# EAGLE design ngptv-lite-v11 (EAGLE 8.4.3)
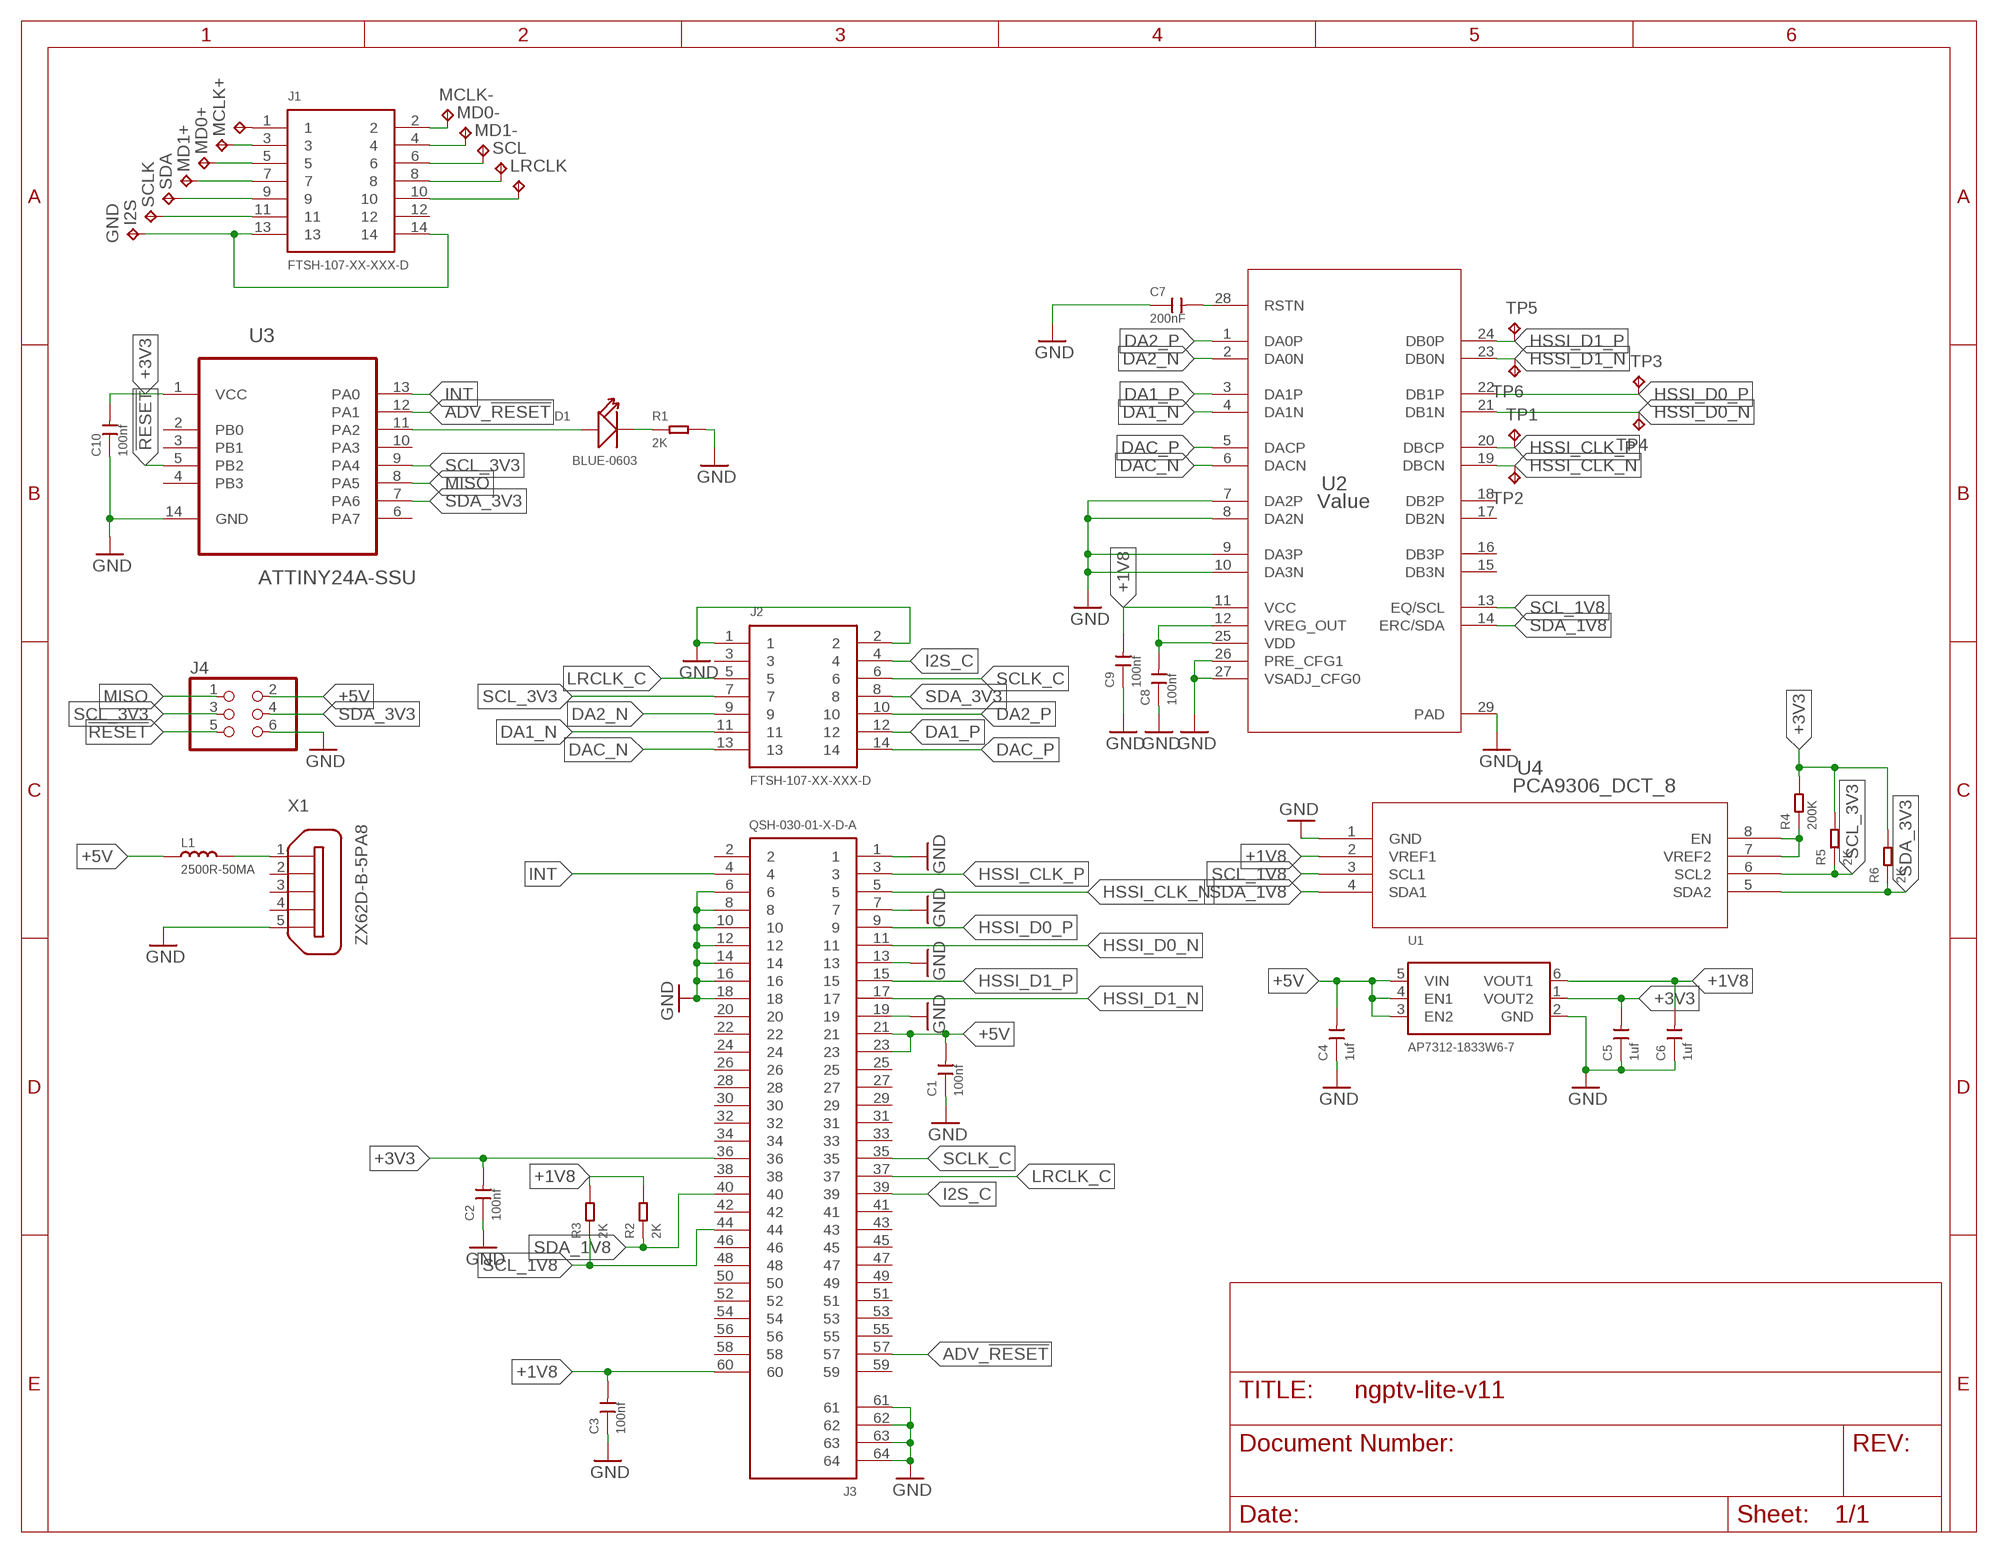
[diagram p0: schematic, sheet 1]

## Parts
C1  100nf  CERAMIC-100NF-50V-10%-X7R(0603)  [C0603]
C2  100nf  CERAMIC-100NF-50V-10%-X7R(0603)  [C0603]
C3  100nf  CERAMIC-100NF-50V-10%-X7R(0603)  [C0603]
C4  1uf  CERAMIC-1UF-25V-10%-X7R(0603)  [C0603]
C5  1uf  CERAMIC-1UF-25V-10%-X7R(0603)  [C0603]
C6  1uf  CERAMIC-1UF-25V-10%-X7R(0603)  [C0603]
C7  200nF  CERAMIC-220NF-25V-10%-X7R(0603)  [C0603]
C8  100nf  CERAMIC-100NF-50V-10%-X7R(0603)  [C0603]
C9  100nf  CERAMIC-100NF-50V-10%-X7R(0603)  [C0603]
C10  100nf  CERAMIC-100NF-50V-10%-X7R(0603)  [C0603]
D1  BLUE-0603  SMD-LED-CLEAR-BLUE(0603)  [LED-0603]
GND  TPTP14R  [TP14R]
I2S  TPTP12R  [TP12R]
J1  FTSH-107-XX-XXX-D  [FTSH-107-XX-XXX-D]
J2  FTSH-107-XX-XXX-D  [FTSH-107-XX-XXX-D]
J3  QSH-030-01-X-D-A  [QSH-030-01-X-D-A]
J4  PINHD-2X3/90  [2X03/90]
L1  2500R-50MA  SMD-FERRITE-BEAD-2500R-50MA(0603)  [L0603]
LRCLK  TPTP12R  [TP12R]
MCLK+  TPTP12R  [TP12R]
MCLK-  TPTP12R  [TP12R]
MD0+  TPTP12R  [TP12R]
MD0-  TPTP12R  [TP12R]
MD1+  TPTP12R  [TP12R]
MD1-  TPTP12R  [TP12R]
R1  2K  SMD-RES-1K-1%-1/10W(0603)  [R0603]
R2  2K  SMD-RES-2K-5%-1/10W(0603)  [R0603]
R3  2K  SMD-RES-2K-5%-1/10W(0603)  [R0603]
R4  200K  SMD-RES-200K-5%-1/10W(0603)  [R0603]
R5  2K  SMD-RES-2K-5%-1/10W(0603)  [R0603]
R6  2K  SMD-RES-2K-5%-1/10W(0603)  [R0603]
SCL  TPTP12R  [TP12R]
SCLK  TPTP12R  [TP12R]
SDA  TPTP12R  [TP12R]
TP1  TPTP06SQ  [TP06SQ]
TP2  TPTP06SQ  [TP06SQ]
TP3  TPTP06SQ  [TP06SQ]
TP4  TPTP06SQ  [TP06SQ]
TP5  TPTP06SQ  [TP06SQ]
TP6  TPTP06SQ  [TP06SQ]
U1  AP7312-1833W6-7  AP7312  [SOT95P280X145-6N]
U2  Value  SN75DPHY440SS  [RHR0028A_NV]
U3  ATTINY24A-SSU  [SOIC127P600X175-14N]
U4  PCA9306_DCT_8  [DCT8]
X1  ZX62D-B-5PA8  [ZX62D-B-5PA8]

## Nets
!RESET: J4.5 U3.5(PB2)
+1V8: C3.2 C6.2 C9.2 J3.60 R2.2 R3.2 U1.6(VOUT1) U2.11(VCC) U4.2(VREF1)
+3V3: C2.2 C5.2 C10.2 J3.36 R4.2 R5.2 R6.2 U1.1(VOUT2) U3.1(VCC)
+5V: C1.2 C4.2 J3.21 J3.23 J4.2 L1.1 U1.3(EN2) U1.4(EN1) U1.5(VIN)
ADV_!RESET: J3.57 U3.12(PA1)
DA1_N: J2.11 U2.4(DA1N)
DA1_P: J2.12 U2.3(DA1P)
DA2_N: J2.9 U2.2(DA0N)
DA2_P: J2.10 U2.1(DA0P)
DAC_N: J2.13 U2.6(DACN)
DAC_P: J2.14 U2.5(DACP)
GND: C1.1 C2.1 C3.1 C4.1 C5.1 C6.1 C7.1 C8.1 C9.1 C10.1 J2.1 J2.2 J3.1 J3.6 J3.7 J3.8 J3.10 J3.12 J3.13 J3.14 J3.16 J3.18 J3.19 J3.61 J3.62 J3.63 J3.64 J4.6 R1.2 U1.2(GND) U2.7(DA2P) U2.8(DA2N) U2.9(DA3P) U2.10(DA3N) U2.26(PRE_CFG1) U2.27(VSADJ_CFG0) U2.29(PAD) U3.14(GND) U4.1(GND) X1.5
GND_H: GND.TP J1.13 J1.14
HSSI_CLK_N: J3.5 TP2.TP U2.19(DBCN)
HSSI_CLK_P: J3.3 TP1.TP U2.20(DBCP)
HSSI_D0_N: J3.11 TP4.TP U2.21(DB1N)
HSSI_D0_P: J3.9 TP3.TP U2.22(DB1P)
HSSI_D1_N: J3.17 TP6.TP U2.23(DB0N)
HSSI_D1_P: J3.15 TP5.TP U2.24(DB0P)
I2S: I2S.TP J1.11
I2S_C: J2.4 J3.39
INT: J3.4 U3.13(PA0)
LRCLK: J1.10 LRCLK.TP
LRCLK_C: J2.5 J3.37
MCLK_N: J1.2 MCLK-.TP
MCLK_P: J1.1 MCLK+.TP
MD0_N: J1.4 MD0-.TP
MD0_P: J1.3 MD0+.TP
MD1_N: J1.6 MD1-.TP
MD1_P: J1.5 MD1+.TP
MISO: J4.1 U3.8(PA5)
SCL: J1.8 SCL.TP
SCL_1V8: J3.44 R3.1 U2.13(EQ/SCL) U4.3(SCL1)
SCL_3V3: J2.7 J4.3 R5.1 U3.9(PA4) U4.6(SCL2)
SCLK: J1.9 SCLK.TP
SCLK_C: J2.6 J3.35
SDA: J1.7 SDA.TP
SDA_1V8: J3.40 R2.1 U2.14(ERC/SDA) U4.4(SDA1)
SDA_3V3: J2.8 J4.4 R6.1 U3.7(PA6) U4.5(SDA2)
STATUS: D1.+ U3.11(PA2)
STATUS_N: D1.- R1.1
TI_!RESET: C7.2 U2.28(RSTN)
USB_VBUS: L1.2 X1.1
VREF2: R4.1 U4.7(VREF2) U4.8(EN)
VREG_OUT: C8.2 U2.12(VREG_OUT) U2.25(VDD)
Unconnected: J1.12 J2.3 J3.2 J3.20 J3.22 J3.24 J3.25 J3.26 J3.27 J3.28 J3.29 J3.30 J3.31 J3.32 J3.33 J3.34 J3.38 J3.41 J3.42 J3.43 J3.45 J3.46 J3.47 J3.48 J3.49 J3.50 J3.51 J3.52 J3.53 J3.54 J3.55 J3.56 J3.58 J3.59 U2.15(DB3N) U2.16(DB3P) U2.17(DB2N) U2.18(DB2P) U3.2(PB0) U3.3(PB1) U3.4(PB3) U3.6(PA7) U3.10(PA3) X1.2 X1.3 X1.4 X1.S1 X1.S2 X1.S3 X1.S4

## Library data of the parts
C1-C3 C8-C10 = Seeed-Capacitor:CERAMIC-100NF-50V-10%-X7R(0603): 302010138; MPN: CC0603KRX7R9BB104
C4-C6 = Seeed-Capacitor:CERAMIC-1UF-25V-10%-X7R(0603): 302010139; MPN: CC0603KRX7R8BB105
C7 = Seeed-Capacitor:CERAMIC-220NF-25V-10%-X7R(0603): 302010073; MPN: CC0603KRX7R8BB224; VALUE: 220nf
D1 = Seeed-LED:SMD-LED-CLEAR-BLUE(0603): 304090045; MPN: 19-217-BHC-ZL1M2RY-3T
GND I2S LRCLK MCLK+ MCLK- MD0+ MD0- MD1+ MD1- SCL SCLK SDA TP1-TP6 = testpad:TP: Test pad
J1 J2 = FTSH-107-XX-XXX-D:FTSH-107-XX-XXX-D: 0.050"X0.050" CL THROUGH HOLE TERMINAL STRIP ASSEMBLY,14PINS.
J3 = QSH-030-01-X-D-A:QSH-030-01-X-D-A: HIGH SPEED SOCKET STRIP, .5mm PITCH, 60 PINS. MANUFACTURER:SAMTEC.
J4 = pinhead:PINHD-2X3: PIN HEADER
L1 = Seeed-Inductor:SMD-FERRITE-BEAD-2500R-50MA(0603): 303030020
R1 = Seeed-Resistor:SMD-RES-1K-1%-1/10W(0603): 301010298; MPN: RC0603FR-071KL; VALUE: 1K
R2 R3 R5 R6 = Seeed-Resistor:SMD-RES-2K-5%-1/10W(0603): 301010113; MPN: RC0603JR-072KL
R4 = Seeed-Resistor:SMD-RES-200K-5%-1/10W(0603): 301010212; MPN: RC0603JR-07200KL
U1 = AP7312:AP7312
U2 = SN75DPHY440SS:SN75DPHY440SS; ALTERNATEPARTNUMBER: SN65DPHY440SS; APPLICATION_BUILDNUMBER: *; COMPTYPE: IC; MANUFACTURER: Texas Instruments; MOUNTTYPE: SMT; PACKAGEREFERENCE: RHR0028A_NV; PARTNUMBER: SN75DPHY440SS; PIN_COUNT: 29; REFDES: RefDes; ROHS: Y; TYPE: TYPE
U3 = Atmel_By_element14_Batch_1-00:ATTINY24A-SSU: 8-bit Microcontroller with In-System Programmable Flash; MPN: ATTINY24A-SSU; OC_FARNELL: 1699395; OC_NEWARK: 80P3681; PACKAGE: SOIC-14; SUPPLIER: Atmel
U4 = PCA9306:PCA9306_DCT_8; DATASHEETURL: httpwww.ti.comlitgpnPCA9306; FAMILY_NAME: I2C SPECIAL FUNCTION; GENERIC_PART_NUMBER: PCA9306; INDUSTRY_STD_PKG_TYPE: SM8; MANUFACTURER: Texas Instruments; MANUFACTURER_PART_NUMBER: pca9306_dct_8; PACKAGE_DESIGNATOR: DCT; PIN_COUNT: 8; VENDOR: Texas Instruments
X1 = zx62d-b-5pa8-oshpark_10:ZX62D-B-5PA8: Micro USB Type B Connector - Standard, Shell Through Hole Source: http://www.hirose.co.jp/cataloge_hp/ed_ZX_20140804.pdf; MF: Hirose; MPN: ZX62D-B-5PA8; OC_FARNELL: 2300438; OC_NEWARK: 69W0712

## Board
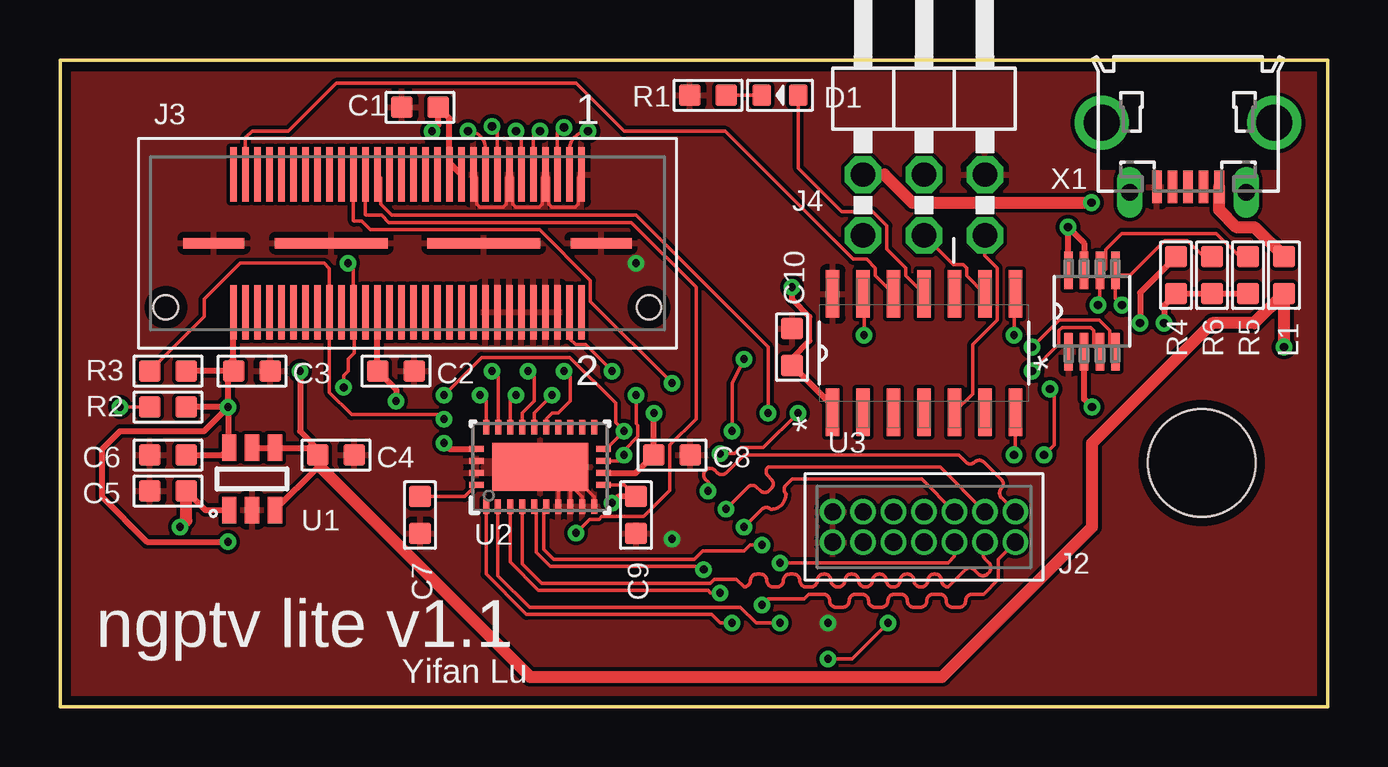
[diagram p1: board, top side]
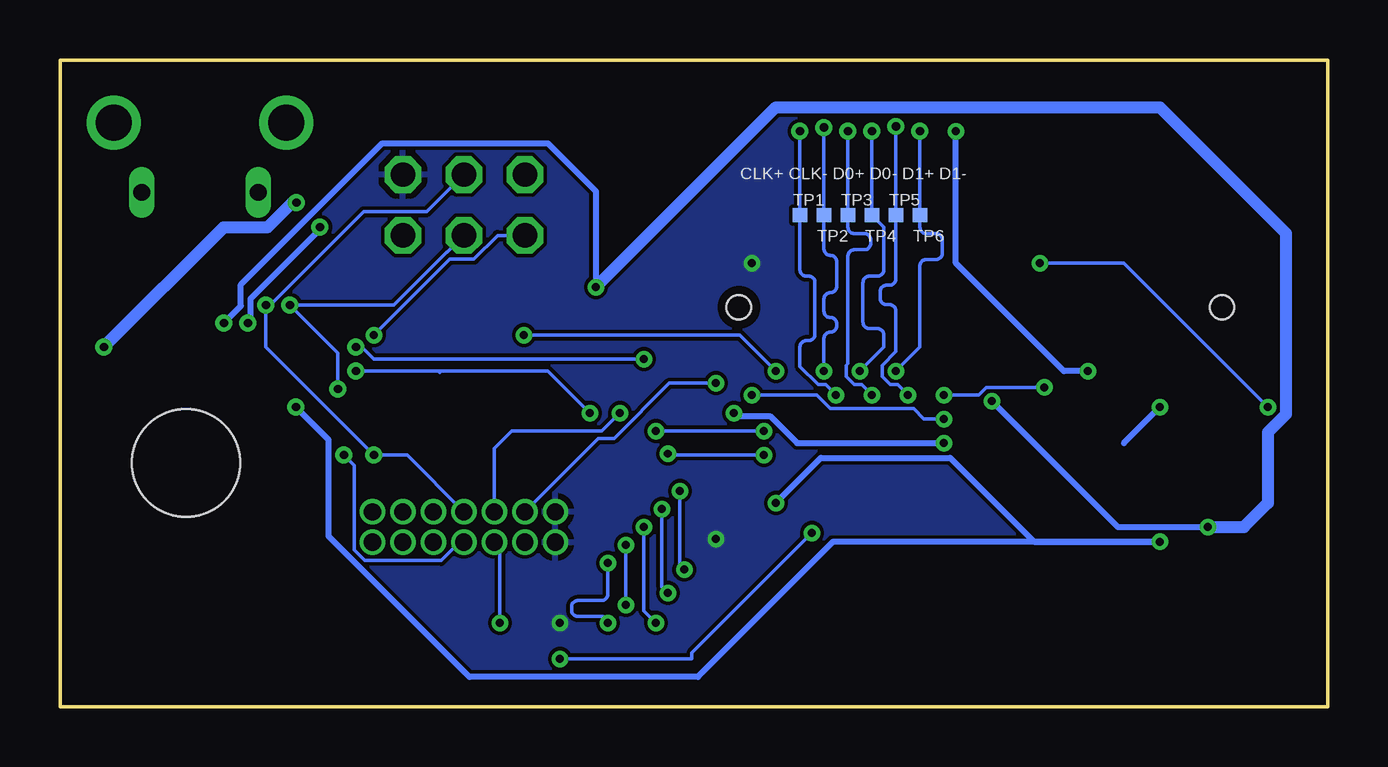
[diagram p2: board, bottom side, seen from below]

Size 52.83 x 26.97 mm. Coordinates in mm from the lower left corner, seen from the top.
Outline: 0,0 52.83,0 52.83,26.97 0,26.97 0,0
Copper layers (1*16): Top 0.0356mm / dielectric 1.5011mm / Bottom 0.0356mm
Design rules "oshpark-2layer": minimum track width 6mil, minimum drill 13mil, track to track 6mil, track to pad 6mil, pad to pad 6mil, via to via 6mil, smd to smd 6mil, copper to edge 15mil, drill to drill 6mil, minimum pad ring 7mil, minimum via ring 7mil, stop-mask expansion 2.5mil, vias tented up to drill 0mil, thermal gap 10mil
Holes 4.5 mm at 47.58,10.16
tKeepout: area 43,5.6 to 52.2,14.8

### Footprints (pad centres in the part's own frame; a part is rotated, then mirrored left to right if it is on the bottom)
C0603 = smd 0.889 x 0.889: 1 0,0.762; 2 0,-0.762
LED-0603 = smd 0.762 x 0.889: + -0.762,0; - 0.762,0
TP14R = smd 1.4 x 1.4: TP 0,0
TP12R = smd 1.2 x 1.2: TP 0,0
FTSH-107-XX-XXX-D = drill 0.711 pad 1.016: 1 -3.81,-0.635; 2 -3.81,0.635; 3 -2.54,-0.635; 4 -2.54,0.635; 5 -1.27,-0.635; 6 -1.27,0.635; 7 0,-0.635; 8 0,0.635; 9 1.27,-0.635; 10 1.27,0.635; 11 2.54,-0.635; 12 2.54,0.635; 13 3.81,-0.635; 14 3.81,0.635
QSH-030-01-X-D-A = smd 0.28 x 2.27: 1 -7.25,-2.87; 2 -7.25,2.87; 3 -6.75,-2.87; 4 -6.75,2.87; 5 -6.25,-2.87; 6 -6.25,2.87; 7 -5.75,-2.87; 8 -5.75,2.87; 9 -5.25,-2.87; 10 -5.25,2.87; 11 -4.75,-2.87; 12 -4.75,2.87; 13 -4.25,-2.87; 14 -4.25,2.87; 15 -3.75,-2.87; 16 -3.75,2.87; 17 -3.25,-2.87; 18 -3.25,2.87; 19 -2.75,-2.87; 20 -2.75,2.87; 21 -2.25,-2.87; 22 -2.25,2.87; 23 -1.75,-2.87; 24 -1.75,2.87; 25 -1.25,-2.87; 26 -1.25,2.87; 27 -0.75,-2.87; 28 -0.75,2.87; 29 -0.25,-2.87; 30 -0.25,2.87; 31 0.25,-2.87; 32 0.25,2.87; 33 0.75,-2.87; 34 0.75,2.87; 35 1.25,-2.87; 36 1.25,2.87; 37 1.75,-2.87; 38 1.75,2.87; 39 2.25,-2.87; 40 2.25,2.87; 41 2.75,-2.87; 42 2.75,2.87; 43 3.25,-2.87; 44 3.25,2.87; 45 3.75,-2.87; 46 3.75,2.87; 47 4.25,-2.87; 48 4.25,2.87; 49 4.75,-2.87; 50 4.75,2.87; 51 5.25,-2.87; 52 5.25,2.87; 53 5.75,-2.87; 54 5.75,2.87; 55 6.25,-2.87; 56 6.25,2.87; 57 6.75,-2.87; 58 6.75,2.87; 59 7.25,-2.87; 60 7.25,2.87 | smd 2.54 x 0.43: 61 -8.065,0; 64 8.065,0 | smd 4.7 x 0.43: 62 -3.175,0; 63 3.175,0 | hole 1.02: -10.065,2.67; 10.065,2.67
2X03/90 = drill 1.016 octagon: 1 -2.54,-6.35; 2 -2.54,-3.81; 3 0,-6.35; 4 0,-3.81; 5 2.54,-6.35; 6 2.54,-3.81
L0603 = smd 0.889 x 0.889: 1 -0.762,0; 2 0.762,0
R0603 = smd 0.889 x 0.889: 1 0,0.762; 2 0,-0.762
TP06SQ = smd 0.6 x 0.6: TP 0,0
SOT95P280X145-6N = smd 1.1 x 0.6: 1 -1.3,0.95; 2 -1.3,0; 3 -1.3,-0.95; 4 1.3,-0.95; 5 1.3,0; 6 1.3,0.95
RHR0028A_NV = smd 0.6 x 0.25: 1 -1.65,2.25; 2 -1.65,1.75; 3 -1.65,1.25; 4 -1.65,0.75; 5 -1.65,0.25; 6 -1.65,-0.25; 7 -1.65,-0.75; 8 -1.65,-1.25; 9 -1.65,-1.75; 10 -1.65,-2.25; 15 1.65,-2.25; 16 1.65,-1.75; 17 1.65,-1.25; 18 1.65,-0.75; 19 1.65,-0.25; 20 1.65,0.25; 21 1.65,0.75; 22 1.65,1.25; 23 1.65,1.75; 24 1.65,2.25 | smd 0.25 x 0.6: 11 -0.75,-2.65; 12 -0.25,-2.65; 13 0.25,-2.65; 14 0.75,-2.65; 25 0.75,2.65; 26 0.25,2.65; 27 -0.25,2.65; 28 -0.75,2.65 | smd 2 x 4: 29 0,0
SOIC127P600X175-14N = smd 1.981 x 0.559: 1 -2.464,3.81; 2 -2.464,2.54; 3 -2.464,1.27; 4 -2.464,0; 5 -2.464,-1.27; 6 -2.464,-2.54; 7 -2.464,-3.81; 8 2.464,-3.81; 9 2.464,-2.54; 10 2.464,-1.27; 11 2.464,0; 12 2.464,1.27; 13 2.464,2.54; 14 2.464,3.81
DCT8 = smd 1.562 x 0.356: 1 -1.695,0.975; 2 -1.695,0.325; 3 -1.695,-0.325; 4 -1.695,-0.975; 5 1.695,-0.975; 6 1.695,-0.325; 7 1.695,0.325; 8 1.695,0.975
ZX62D-B-5PA8 = smd 1.35 x 0.4: 1 4.825,1.3; 2 4.825,0.65; 3 4.825,0; 4 4.825,-0.65; 5 4.825,-1.3 | drill 1.5: S1 2.15,-3.6; S2 2.15,3.6 | drill 0.7 long: S3 5.05,2.425; S4 5.05,-2.425

### Placement (x,y rotation side)
C1  15,25 90 top
C2  14,14 270 top
C3  8,14 270 top
C4  11.5,10.5 270 top
C5  4.5,9 90 top
C6  4.5,10.5 90 top
C7  15,8 180 top
C8  25.5,10.5 270 top
C9  24,8 180 top
C10  30.5,15 0 top
D1  30,25.5 180 top
GND  -41.91,44.45 0 top  (outside the outline)
I2S  -20.32,54.61 0 top  (outside the outline)
J1  -29.21,38.1 0 top  (outside the outline)
J2  36,7.5 0 top
J3  14.48,19.33 180 top
J4  36,26 0 top
L1  51,18 90 top
LRCLK  -57.15,44.45 0 top  (outside the outline)
MCLK+  -49.53,44.45 0 top  (outside the outline)
MCLK-  -19.05,50.8 0 top  (outside the outline)
MD0+  -25.4,50.8 0 top  (outside the outline)
MD0-  -44.45,50.8 0 top  (outside the outline)
MD1+  -31.75,50.8 0 top  (outside the outline)
MD1-  -50.8,50.8 0 top  (outside the outline)
R1  27,25.5 270 top
R2  4.5,12.5 90 top
R3  4.5,14 90 top
R4  46.5,18 0 top
R5  49.5,18 0 top
R6  48,18 0 top
SCL  -16.51,54.61 0 top  (outside the outline)
SCLK  -38.1,50.8 0 top  (outside the outline)
SDA  -55.88,50.8 0 top  (outside the outline)
TP1  22,20.5 0 bottom
TP2  21,20.5 0 bottom
TP3  20,20.5 0 bottom
TP4  19,20.5 0 bottom
TP5  18,20.5 0 bottom
TP6  17,20.5 0 bottom
U1  8,9.5 90 top
U2  20,10 90 top
U3  36,14.75 90 top
U4  43,16.5 90 top
X1  47,26.5 270 top

### Tracks (layer width: path | path; a pad name or v marks a point on that pad's centre or on a via)
!RESET
  Top 0.152: U3.5 38.03,13.05 38.03,15.11 39.05,16.13 39.05,18.3 38.54,18.81 J4.5
+1V8  (via drill 0.33, 0.35)
  Top 0.152: U2.11 23.51,9.25 C9.2
  Top 0.254: 7.23,14.5 7.23,14.01 C3.2 R3.2 | 7.23,14.5 J3.60 | 7,10.75 U1.6 | C6.2 6.75,10.5 7,10.75 | C9.2 23.26,8.76 v23,8.5 | v7,12.5 7,10.75 | v7,12.5 7,14.27 7.23,14.5 | v7,12.5 R2.2 | v7,6.88 3.62,6.88 1.75,8.75 1.75,10.75 2.5,11.5 6,11.5 v7,12.5 | v43,12.5 42.67,12.82 U4.2
  Bottom 0.254: 8.5,11 v7,12.5 | v23,8.5 21.12,10.38 15.74,10.38 12.24,6.88 v7,6.88 20.62,6.88 26.25,1.25 35.78,1.25 41.63,7.11 41.63,11.13 v43,12.5
+3V3  (via drill 0.33, 0.35)
  Top 0.254: U3.1 32.19,12.55 C10.2 30.5,14.54 31.22,15.27 31.22,16.26 30.5,16.98 v30.5,17.5 | J3.36 13.23,14.01 C2.2 14,13.24 v14,12.75 | C5.2 6.06,8.2 U1.1 | v46,16 46,16.74 R4.2 R6.2 R5.2
  Top 0.508: v5,7.5 5.26,7.76 C5.2
  Bottom 0.254: v14,12.75 8.75,7.5 v5,7.5 | v46,16 45.29,16.71 45.29,17.61 39.39,23.5 32.5,23.5 30.5,21.5 v30.5,17.5
  Bottom 0.508: v30.5,17.5 23,25 7,25 1.75,19.75 1.75,12.19 2.5,11.44 2.5,8.5 3.5,7.5 v5,7.5
+5V  (via drill 0.33, 0.35)
  Top 0.254: 16.23,22.7 J3.23 | J3.21 16.23,22.7 | 16.23,22.7 16.23,24.53 C1.2 15.76,24.26 v15.5,24 | C4.2 10.44,10.8 U1.4 U1.5 | U1.3 10.74,9.99 C4.2 | 10.5,10.74 C4.2 | v10,14 10,11.5 10.86,10.64 10.86,10.38
  Top 0.508: C4.2 10.86,10.38 10.86,9.98 19.59,1.25 36.75,1.25 43,7.5 43,11 48,16 49.76,16 L1.1 v51,15 | J4.2 34.35,22.19 35.52,21.02 v42.98,21.02
  Bottom 0.254: v15.5,24 15.5,18.5 11,14 v10,14
  Bottom 0.508: v42.98,21.02 43.15,21.02 44.19,19.99 46.01,19.99 v51,15
ADV_!RESET
  Top 0.152: U3.12 33.97,17.98 33.97,18.3 33.61,18.66 33.05,18.66 27.71,24 23.5,24 21.5,26 11.5,26 9.5,24 8,24 7.73,23.73 J3.57
DA1_N
  Top 0.152: U2.4 19.25,5.97 20.06,5.15 27.09,5.15 27.26,5.32 28.18,5.32 28.5,5 arc90 28.77,5.27 arc-90 29.03,5.53 29.19,5.53 arc-90 29.45,5.27 arc90 29.72,5 29.87,5 arc90 30.14,5.27 arc-90 30.41,5.53 30.56,5.53 arc-90 30.83,5.27 arc90 31.09,5 31.29,5 arc90 31.55,5.27 arc-90 31.82,5.53 31.86,5.53 arc-90 32.13,5.27 arc90 32.39,5 32.44,5 arc90 32.7,5.27 arc-90 32.97,5.53 33.01,5.53 arc-90 33.28,5.27 arc90 33.55,5 33.59,5 arc90 33.85,5.27 arc-90 34.12,5.53 34.16,5.53 arc-90 34.43,5.27 arc90 34.7,5 34.74,5 arc90 35.01,5.27 arc-90 35.27,5.53 35.31,5.53 arc-90 35.58,5.27 arc90 35.85,5 35.89,5 arc90 36.16,5.27 arc-90 36.42,5.53 36.47,5.53 arc-90 36.73,5.27 arc90 37,5 37.72,5.72 arc-90 38.09,5.72 38.27,5.54 arc90 38.65,5.54 38.71,5.61 arc90 38.71,5.99 38.54,6.16 arc-90 38.54,6.54 J2.11
DA1_P  (via drill 0.33)
  Top 0.152: J2.12 36.67,10 29.5,10 arc90 29.5,9.62 29.64,9.48 arc-90 29.64,9.1 29.55,9.01 arc-90 29.18,9.01 29.03,9.16 arc90 28.66,9.16 v27.75,8.25 | U2.3 18.75,6.03 19.94,4.85 27,4.85 27.1,4.75 v27.5,4.75
  Bottom 0.152: v27.5,4.75 27.75,5 v27.75,8.25
DA2_N  (via drill 0.33)
  Top 0.152: U2.2 18.25,5.47 19.56,4.15 28.35,4.15 29,3.5 v30,3.5 | J2.9 37.27,6.27 37,6 v30,6
  Bottom 0.152: v30,6 30,4.7 arc90 30.27,4.43 31.25,4.43 arc-90 31.52,4.16 31.52,4.03 arc-90 31.25,3.77 30.27,3.77 arc90 v30,3.5
DA2_P  (via drill 0.33)
  Top 0.152: J2.10 35.91,9.5 30.5,9.5 30.25,9.25 arc90 30.25,8.87 | U2.1 17.75,5.53 19.39,3.89 | 19.39,3.89 19.44,3.85 | 19.39,3.89 | 19.39,3.89 19.44,3.85 | 27.15,3.85 19.44,3.85 | v28.5,7.5 29.23,8.23 arc-90 29.61,8.23 arc90 30.25,8.87 | v28,3.5 27.5,3.5 27.15,3.85 | 27.15,3.85 | 30.25,8.87
  Bottom 0.152: v28.5,7.5 28.5,4 v28,3.5
DAC_N  (via drill 0.33)
  Top 0.152: U2.6 20.15,8.25 20.15,6.56 20.56,6.15 26.44,6.15 26.78,6.5 28.5,6.5 28.75,6.75 v29.25,6.75 | v29.25,4.25 29.5,4.5 31,4.5 31.2,4.7 31.8,4.7 arc-90 32.07,4.43 32.07,4.42 arc90 32.34,4.15 32.61,4.15 arc90 32.88,4.42 32.88,4.43 arc-90 33.15,4.7 33.42,4.7 arc-90 33.69,4.43 33.69,4.42 arc90 33.95,4.15 34.23,4.15 arc90 34.5,4.42 34.5,4.43 arc-90 34.76,4.7 35.04,4.7 arc-90 35.31,4.43 35.31,4.42 arc90 35.57,4.15 35.85,4.15 arc90 36.12,4.42 36.12,4.43 arc-90 36.38,4.7 36.66,4.7 arc-90 36.92,4.43 36.92,4.42 arc90 37.19,4.15 37.47,4.15 arc90 37.73,4.42 37.73,4.43 arc-90 38,4.7 38.49,4.7 39.1,5.31 39.1,6.15 J2.13
  Bottom 0.152: v29.25,4.25 v29.25,6.75
DAC_P  (via drill 0.33)
  Top 0.152: J2.14 39.22,8.72 arc-90 39.22,9.1 arc90 39.22,9.48 38.49,10.21 arc90 38.12,10.21 arc-90 37.74,10.21 37.45,10.5 28.5,10.5 27.76,9.76 arc-90 27.38,9.76 27.28,9.87 arc90 26.9,9.87 26.89,9.86 arc90 26.89,9.48 27,9.38 arc-90 v27,9 | U2.5 19.85,8.25 19.85,6.44 20.44,5.85 26.69,5.85 v26.82,5.72
  Bottom 0.152: v26.82,5.72 27,5.91 v27,9
GND  (via drill 0.33)
  Top 0.152: J3.19 17.36,22.07 17.36,20.97 17.49,20.84 18.46,20.84 18.6,20.97 18.6,22.07 J3.13 18.86,22.07 18.86,20.97 18.99,20.84 19.96,20.84 20.1,20.97 20.1,22.07 J3.7 20.36,22.07 20.36,20.97 20.49,20.84 21.46,20.84 21.6,20.97 21.6,22.07 J3.1 | U2.7 20.75,10.25 20.5,10.5 20.25,10.25 | 20.25,10.25 U2.29 21,10 22.25,8.75 U2.10 | U2.8 21.25,9.25 | 21.25,9.25 20.25,10.25 | U2.9 21.75,8.75 21.25,9.25
  other vias: 32,3.5 25.5,7 24,18.5
  pour Top (rank 2): 0,27 0,0 53,0 53,27
  pour Bottom (rank 2): 0,27 0,0 53,0 53,27
GND_H  (2 unrouted)
HSSI_CLK_N  (via drill 0.33, 0.35)
  Top 0.152: U2.19 20.25,12 20.5,12.25 20.75,12.25 21.25,12.75 21.25,13.75 v21,14 | J3.5 20.73,23.93 arc-90 v21,24.15
  Bottom 0.152: v21,24.15 TP2.TP 21,19.09 arc-90 20.73,18.82 arc90 20.47,18.56 20.47,17.53 arc90 20.73,17.27 arc-90 21,17 21,16.5 arc-90 20.73,16.23 arc90 20.47,15.97 20.47,15.89 arc90 20.73,15.62 arc-90 21,15.36 v21,14
HSSI_CLK_P  (via drill 0.33, 0.35)
  Top 0.152: v22,24 arc90 21.23,23.23 J3.3 | U2.20 19.75,12.25 v20.5,13
  Bottom 0.152: v22,24 TP1.TP 22,18.23 arc-90 21.73,17.96 21.64,17.96 arc90 21.37,17.69 21.37,15.53 arc90 21.64,15.27 21.73,15.27 arc-90 22,15 22,14.19 21.24,13.43 20.93,13.43 v20.5,13
HSSI_D0_N  (via drill 0.33, 0.35)
  Top 0.152: v19,24 arc-90 19.23,23.77 J3.11 | U2.21 19.25,12.25 19.75,12.75 19.75,13.75 v19.5,14
  Bottom 0.152: v19,24 TP4.TP 18.5,20 18.5,18.23 arc90 18.77,17.96 19.11,17.96 arc-90 19.37,17.69 19.37,16.03 arc-90 19.11,15.77 18.77,15.77 arc90 18.5,15.5 18.5,15 v19.5,14
HSSI_D0_P  (via drill 0.33, 0.35)
  Top 0.152: v20,24 arc90 19.73,23.73 J3.9 | U2.22 18.75,12.75 v19,13
  Bottom 0.152: v20,24 TP3.TP 20,20 arc-90 19.73,19.73 19.32,19.73 arc90 19.05,19.47 19.05,19.32 arc90 19.32,19.05 19.73,19.05 arc-90 20,18.79 20,14.31 20.07,14.24 20.07,13.76 19.74,13.43 19.43,13.43 v19,13
HSSI_D1_N  (via drill 0.33, 0.35)
  Top 0.152: v17,24 arc-90 17.73,23.27 J3.17 | U2.23 18.25,13.75 v18,14
  Bottom 0.152: v17,24 TP6.TP 17,20 arc-90 16.73,19.73 16.33,19.73 arc90 16.06,19.47 16.06,18.92 arc90 16.33,18.65 16.73,18.65 arc-90 17,18.38 17,15 v18,14
HSSI_D1_P  (via drill 0.33, 0.35)
  Top 0.152: U2.24 17.75,12.75 v17.5,13 | J3.15 18.23,23.97 arc90 v18,24.2
  Bottom 0.152: v18,24.2 TP5.TP 18,17.84 arc90 18.27,17.58 18.39,17.58 arc-90 18.66,17.31 18.66,17.03 arc-90 18.39,16.77 18.27,16.77 arc90 18,16.5 18,14.81 18.57,14.24 18.57,13.76 18.24,13.43 17.93,13.43 v17.5,13
I2S  (1 unrouted)
I2S_C  (via drill 0.33)
  Top 0.152: v25.5,13.5 22.1,16.9 22.1,17.77 19.98,19.89 12.93,19.89 12.57,20.25 12.25,20.25 12.23,20.27 J3.39
  Bottom 0.152: J2.4 30.4,11.2 29.75,11.2 27.44,13.5 v25.5,13.5
INT  (via drill 0.33)
  Top 0.152: U3.13 33.5,17.17 v33.5,15.5 | v23,14 21.91,15.1 21.49,15.1 21.23,15.36 J3.4
  Bottom 0.152: v33.5,15.5 24.5,15.5 v23,14
LRCLK  (1 unrouted)
LRCLK_C  (via drill 0.33)
  Top 0.152: J3.37 12.73,20.52 12.75,20.5 13.4,20.5 13.7,20.2 23.8,20.2 26.5,17.5 26.5,12 25.41,10.91 25.41,9.03 24.31,7.93 23,7.93 | v34.5,3.5 33,2 v32,2 | 23,7.93 22.58,7.93 | v21.5,7.25 22.07,7.82 22.47,7.82 22.58,7.93 | 22.58,7.93 23,7.93
  Bottom 0.152: J2.5 34.5,6.63 v34.5,3.5 | v32,2 26.5,2 26.5,2.25 v21.5,7.25
MCLK_N  (1 unrouted)
MCLK_P  (1 unrouted)
MD0_N  (1 unrouted)
MD0_P  (1 unrouted)
MD1_N  (1 unrouted)
MD1_P  (1 unrouted)
MISO  (via drill 0.33)
  Top 0.152: U3.8 39.75,17.15 v39.75,15.5
  Bottom 0.152: v39.75,15.5 36.59,18.66 35.59,18.66 34.6,19.65 J4.1
SCL  (1 unrouted)
SCL_1V8  (via drill 0.33, 0.35)
  Top 0.152: U2.13 23.25,10.25 v23.5,10.5 23.5,10.69 24.07,11.26 24.07,11.74 24,11.81 v24,13 | v27.5,10.55 28.12,10.55 28.37,10.8 29.3,10.8 v30.75,12.25 | R3.1 6,16.26 6,17 7.5,18.5 11,18.5 11.23,18.27 11.23,16.5 | 11.23,16.5 J3.44 11.23,13.1 12.15,12.18 15.82,12.18 v16,12 | 11.25,16.48 11.23,16.5 | U4.3 43.08,15.05 43.08,15.68 42.95,15.81 41.75,15.81 41.62,15.68 41.62,15.12 v40.5,14
  Bottom 0.152: v23.5,10.5 27.45,10.5 v27.5,10.55 | v30.75,12.25 32.5,14 36.93,14 | 37,13.93 36.93,14 | v24,13 21.31,13 20.74,12.43 17.26,12.43 16.84,12 v16,12 | 36.93,14 v40.5,14
SCL_3V3  (via drill 0.35)
  Top 0.152: 38.5,17.25 U3.9 37.78,17.98 37.78,18.3 37.64,18.43 37.22,18.43 J4.3 | 43.33,18 U4.6 | 43.33,18 43.33,16.82 v43.25,16.75 | v41,10.5 41.42,10.92 41.42,11.5 | 41.42,11.5 41.42,11.74 | 43.33,18 43.57,18.24 43.57,19.07 44.24,19.74 48.17,19.74 49.15,18.76 R5.1 | 41.42,11.5 41.42,13.08 v41.25,13.25
  Bottom 0.152: J4.3 36.69,18.96 36.72,18.96 38.93,16.75 v43.25,16.75 41.25,14.75 v41.25,13.25 | J2.7 36.19,6.87 36.95,6.1 40.13,6.1 40.57,6.55 40.57,10.07 v41,10.5
SCLK  (1 unrouted)
SCLK_C  (via drill 0.33)
  Top 0.152: J3.35 13.36,22.07 13.36,20.97 13.83,20.5 24,20.5 29.5,15 v29.5,12.25
  Bottom 0.152: v29.5,12.25 30.25,11.5 34,11.5 34.73,10.77 J2.6
SDA  (1 unrouted)
SDA_1V8  (via drill 0.33, 0.35)
  Top 0.152: U2.14 22.75,10.75 v23.5,11.5 23.15,11.85 23.15,12.66 21.24,14.57 17.57,14.57 v16,13 | v28,11.5 28,13.5 v28.5,14.5 | 12.23,16.5 J3.40 | 12.23,16.5 12.23,18.27 v12,18.5 | v2.5,12.5 R2.1 | v11.82,13.32 11.82,13.82 12,14 12,14.5 12.25,14.75 12.25,16.48 12.23,16.5 | U4.4 43.73,15.05 43.73,15.68 43.29,16.12 41.63,16.12 v40.51,15 v40.5,15
  Bottom 0.152: v23.5,11.5 v28,11.5 | v28.5,14.5 39.75,14.5 40.25,15 v40.5,15 | v12,18.5 8.5,18.5 v2.5,12.5 | v16,13 14.56,13 14.24,13.32 12.18,13.32 12,13.5 v11.82,13.32
SDA_3V3  (via drill 0.35)
  Top 0.152: 39.8,12.3 U3.7 | 39.8,12.3 39.75,12.35 | 43.98,18 U4.5 | 43.98,18 43.98,17.02 v44.25,16.75 | v39.75,10.5 39.8,10.55 39.8,12.3 | 43.98,18 44.59,18 46.03,19.43 46.97,19.43 47.65,18.76 R6.1
  Bottom 0.152: J4.4 37.55,20.64 40.18,20.64 44.07,16.75 v44.25,16.75 44.25,15 v39.75,10.5 38.37,10.5 J2.8
STATUS
  Top 0.152: U3.11 35.24,17.98 35.24,18.3 34.45,19.09 34.45,20.06 33.87,20.64 32.57,20.64 30.76,22.45 D1.+
STATUS_N
  Top 0.152: D1.- R1.1
TI_!RESET
  Top 0.152: U2.28 16.86,8.76 C7.2
USB_VBUS
  Top 0.508: L1.2 49.77,19.99 49.04,19.99 48.3,20.73 X1.1
VREF2  (via drill 0.35)
  Top 0.254: R4.1 45,17.26 v45,16 | U4.8 42,18.22 v42,20 42.67,19.32 U4.7
  Bottom 0.254: v45,16 44.88,16.12 44.88,17.01 42,19.89 v42,20
VREG_OUT  (via drill 0.33)
  Top 0.254: U2.12 23.99,9.75 C8.2 24.74,11.99 v24.75,12.25 | v16,11 16.25,10.75 U2.25
  Bottom 0.254: v24.75,12.25 24.62,12.12 23.24,12.12 22.12,11 v16,11

### Text on the board
tPlace: ngptv lite v1.1 | Yifan Lu
bPlace: CLK+ CLK- D0+ D0- D1+ D1-